# EAGLE design RadioRX (EAGLE 9.6.2)
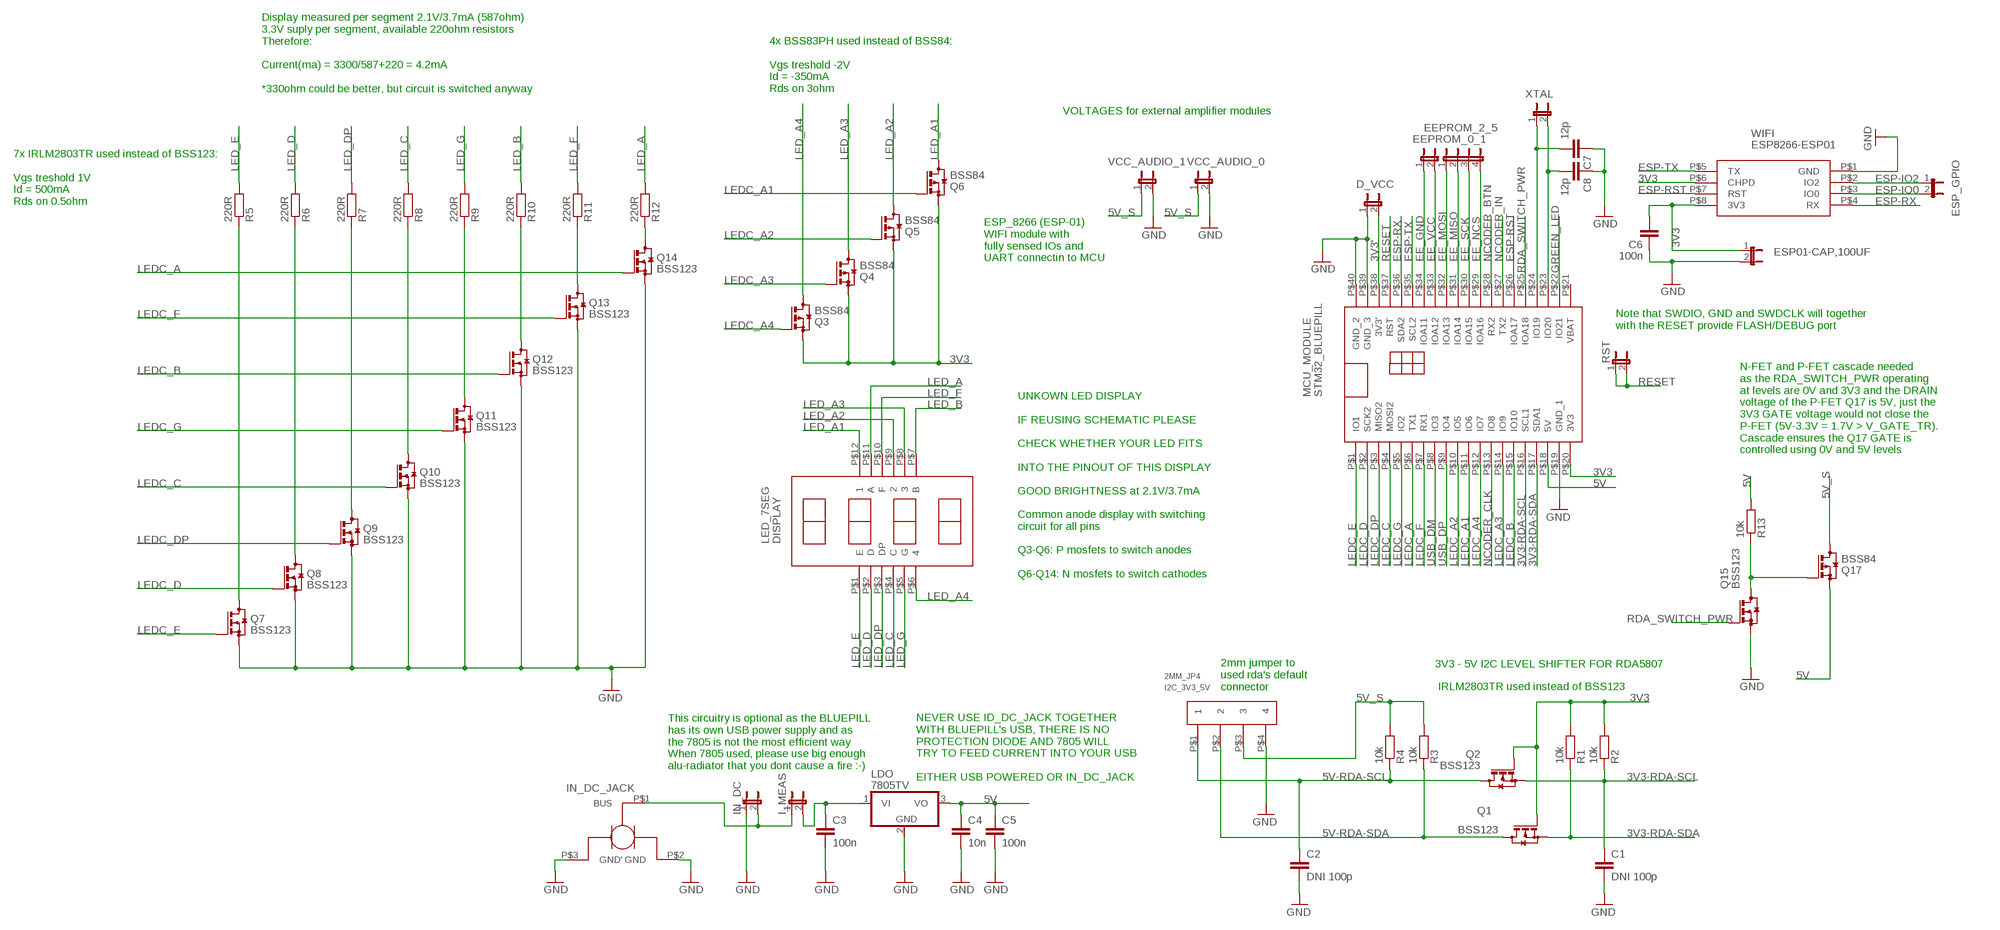
[diagram p0: schematic, sheet 1]

## Parts
C1  DNI 100p  C-EUC0805  [C0805]
C2  DNI 100p  C-EUC0805  [C0805]
C3  100n  C-EUC0805  [C0805]
C4  10n  C-EUC0805  [C0805]
C5  100n  C-EUC0805  [C0805]
C6  100n  C-EUC0805  [C0805]
C7  12p  C-EUC0603  [C0603]
C8  12p  C-EUC0603  [C0603]
D_VCC  JP1E  [JP1]
DISPLAY  LED_7SEG  [LED_7SEG]
EEPROM_0_1  JP1E  [JP1]
EEPROM_2_5  JP4E  [JP4]
ESP01-CAP,100UF  JP1E  [JP1]
ESP_GPIO  JP1E  [JP1]
I2C_3V3_5V  2MM_JP4  [2MM_JP4]
I_MEAS  JP1E  [JP1]
IN_DC  JP1E  [JP1]
IN_DC_JACK  DC_CONN  [DC_CONN]
LDO  7805TV  [TO220V]
MCU_MODULE  STM32_BLUEPILL  [STM32_BLUEPILL]
Q1  BSS123  [SOT23]
Q2  BSS123  [SOT23]
Q3  BSS84  [SOT23]
Q4  BSS84  [SOT23]
Q5  BSS84  [SOT23]
Q6  BSS84  [SOT23]
Q7  BSS123  [SOT23]
Q8  BSS123  [SOT23]
Q9  BSS123  [SOT23]
Q10  BSS123  [SOT23]
Q11  BSS123  [SOT23]
Q12  BSS123  [SOT23]
Q13  BSS123  [SOT23]
Q14  BSS123  [SOT23]
Q15  BSS123  [SOT23]
Q17  BSS84  [SOT23]
R1  10k  R-EU_R0805  [R0805]
R2  10k  R-EU_R0805  [R0805]
R3  10k  R-EU_R0805  [R0805]
R4  10k  R-EU_R0805  [R0805]
R5  220R  R-EU_R0805  [R0805]
R6  220R  R-EU_R0805  [R0805]
R7  220R  R-EU_R0805  [R0805]
R8  220R  R-EU_R0805  [R0805]
R9  220R  R-EU_R0805  [R0805]
R10  220R  R-EU_R0805  [R0805]
R11  220R  R-EU_R0805  [R0805]
R12  220R  R-EU_R0805  [R0805]
R13  10k  R-EU_R0805  [R0805]
RST  JP1E  [JP1]
VCC_AUDIO_0  JP1E  [JP1]
VCC_AUDIO_1  JP1E  [JP1]
WIFI  ESP8266-ESP01  [ESP8266-ESP01]
XTAL  JP1E  [JP1]

## Nets
3V3: C6.2 ESP01-CAP,100UF.1 MCU_MODULE.P$20(3V3) Q1.1(G) Q2.1(G) Q3.2(S) Q4.2(S) Q5.2(S) Q6.2(S) R1.2 R2.2 WIFI.P$6(CHPD) WIFI.P$8(3V3)
3V3': D_VCC.2 MCU_MODULE.P$38(3V3')
3V3-RDA-SCL: C1.1 MCU_MODULE.P$16(SCL1) Q2.2(S) R2.1
3V3-RDA-SDA: MCU_MODULE.P$17(SDA1) Q1.2(S) R1.1
5V: C4.1 C5.1 LDO.3(VO) MCU_MODULE.P$18(5V) Q17.2(S) R13.2
5V-RDA-SCL: C2.1 I2C_3V3_5V.P$1 Q2.3(D) R4.1
5V-RDA-SDA: I2C_3V3_5V.P$2 Q1.3(D) R3.1
5V_S: I2C_3V3_5V.P$3 Q17.3(D) R3.2 R4.2 VCC_AUDIO_0.1 VCC_AUDIO_1.1
EE_GND: EEPROM_0_1.1 MCU_MODULE.P$34(IOA11)
EE_MISO: EEPROM_2_5.2 MCU_MODULE.P$31(IOA14)
EE_MOSI: EEPROM_2_5.1 MCU_MODULE.P$32(IOA13)
EE_NCS: EEPROM_2_5.4 MCU_MODULE.P$29(IOA16)
EE_SCK: EEPROM_2_5.3 MCU_MODULE.P$30(IOA15)
EE_VCC: EEPROM_0_1.2 MCU_MODULE.P$33(IOA12)
ESP-IO0: ESP_GPIO.2 WIFI.P$3(IO0)
ESP-IO2: ESP_GPIO.1 WIFI.P$2(IO2)
ESP-RST: MCU_MODULE.P$26(IOA17) WIFI.P$7(RST)
ESP-RX: MCU_MODULE.P$36(SDA2) WIFI.P$4(RX)
ESP-TX: MCU_MODULE.P$35(SCL2) WIFI.P$5(TX)
GND: C1.2 C2.2 C3.2 C4.2 C5.2 C6.1 C7.1 C8.1 D_VCC.1 ESP01-CAP,100UF.2 I2C_3V3_5V.P$4 IN_DC.1 IN_DC_JACK.P$2(GND) IN_DC_JACK.P$3(GND') LDO.2(GND) MCU_MODULE.P$19(GND_1) MCU_MODULE.P$39(GND_3) MCU_MODULE.P$40(GND_2) Q7.2(S) Q8.2(S) Q9.2(S) Q10.2(S) Q11.2(S) Q12.2(S) Q13.2(S) Q14.2(S) Q15.2(S) VCC_AUDIO_0.2 VCC_AUDIO_1.2 WIFI.P$1(GND)
GREEN_LED: MCU_MODULE.P$22(IO21)
LED_A: DISPLAY.P$11(A) R12.2
LED_A1: DISPLAY.P$12 Q6.3(D)
LED_A2: DISPLAY.P$9 Q5.3(D)
LED_A3: DISPLAY.P$8 Q4.3(D)
LED_A4: DISPLAY.P$6 Q3.3(D)
LED_B: DISPLAY.P$7(B) R10.2
LED_C: DISPLAY.P$4(C) R8.2
LED_D: DISPLAY.P$2(D) R6.2
LED_DP: DISPLAY.P$3(DP) R7.2
LED_E: DISPLAY.P$1(E) R5.2
LED_F: DISPLAY.P$10(F) R11.2
LED_G: DISPLAY.P$5(G) R9.2
LEDC_A: MCU_MODULE.P$6(TX1) Q14.1(G)
LEDC_A1: MCU_MODULE.P$11(IO6) Q6.1(G)
LEDC_A2: MCU_MODULE.P$10(IO5) Q5.1(G)
LEDC_A3: MCU_MODULE.P$14(IO9) Q4.1(G)
LEDC_A4: MCU_MODULE.P$12(IO7) Q3.1(G)
LEDC_B: MCU_MODULE.P$15(IO10) Q12.1(G)
LEDC_C: MCU_MODULE.P$4(MOSI2) Q10.1(G)
LEDC_D: MCU_MODULE.P$2(SCK2) Q8.1(G)
LEDC_DP: MCU_MODULE.P$3(MISO2) Q9.1(G)
LEDC_E: MCU_MODULE.P$1(IO1) Q7.1(G)
LEDC_F: MCU_MODULE.P$7(RX1) Q13.1(G)
LEDC_G: MCU_MODULE.P$5(IO2) Q11.1(G)
N$1: C3.1 I_MEAS.2 LDO.1(VI)
N$2: I_MEAS.1 IN_DC.2 IN_DC_JACK.P$1(BUS)
N$3: C8.2 MCU_MODULE.P$23(IO20) XTAL.2
N$4: C7.2 MCU_MODULE.P$24(IO19) XTAL.1
N$15: Q15.3(D) Q17.1(G) R13.1
N$18: Q7.3(D) R5.1
N$19: Q8.3(D) R6.1
N$20: Q9.3(D) R7.1
N$21: Q10.3(D) R8.1
N$22: Q11.3(D) R9.1
N$23: Q12.3(D) R10.1
N$24: Q13.3(D) R11.1
N$26: Q14.3(D) R12.1
NCODER_BTN: MCU_MODULE.P$28(RX2)
NCODER_CLK: MCU_MODULE.P$13(IO8)
NCODER_IN: MCU_MODULE.P$27(TX2)
RDA_SWITCH_PWR: MCU_MODULE.P$25(IOA18) Q15.1(G)
RESET: MCU_MODULE.P$37(RST) RST.1 RST.2
USB_DM: MCU_MODULE.P$8(IO3)
USB_DP: MCU_MODULE.P$9(IO4)
Unconnected: MCU_MODULE.P$21(VBAT)

## Notes on the sheet
- Display measured per segment 2.1V/3.7mA (587ohm)
  3.3V suply per segment, available 220ohm resistors
  Therefore:
  
  Current(ma) = 3300/587+220 = 4.2mA
  
  *330ohm could be better, but circuit is switched anyway
- 4x BSS83PH used instead of BSS84:
  
  Vgs treshold -2V
  Id = -350mA
  Rds on 3ohm
- VOLTAGES for external amplifier modules
- 7x IRLM2803TR used instead of BSS123:
  
  Vgs treshold 1V
  Id = 500mA
  Rds on 0.5ohm
- ESP_8266 (ESP-01)
  WIFI module with
  fully sensed IOs and
  UART connectin to MCU
- Note that SWDIO, GND and SWDCLK will together
  with the RESET provide FLASH/DEBUG port
- N-FET and P-FET cascade needed
  as the RDA_SWITCH_PWR operating
  at levels are 0V and 3V3 and the DRAIN 
  voltage of the P-FET Q17 is 5V, just the
  3V3 GATE voltage would not close the
  P-FET (5V-3.3V = 1.7V > V_GATE_TR).
  Cascade ensures the Q17 GATE is 
  controlled using 0V and 5V levels
- UNKOWN LED DISPLAY
  
  IF REUSING SCHEMATIC PLEASE
  
  CHECK WHETHER YOUR LED FITS
  
  INTO THE PINOUT OF THIS DISPLAY
  
  GOOD BRIGHTNESS at 2.1V/3.7mA
  
  Common anode display with switching
  circuit for all pins 
  
  Q3-Q6: P mosfets to switch anodes
  
  Q6-Q14: N mosfets to switch cathodes
- 3V3 - 5V I2C LEVEL SHIFTER FOR RDA5807
- 2mm jumper to
  used rda's default
  connector
- IRLM2803TR used instead of BSS123
- This circuitry is optional as the BLUEPILL
  has its own USB power supply and as
  the 7805 is not the most efficient way
  When 7805 used, please use big enough
  alu-radiator that you dont cause a fire :-)
- NEVER USE ID_DC_JACK TOGETHER
  WITH BLUEPILL's USB, THERE IS NO
  PROTECTION DIODE AND 7805 WILL
  TRY TO FEED CURRENT INTO YOUR USB
  
  EITHER USB POWERED OR IN_DC_JACK

## Library data of the parts
C1-C8 = rcl:C-EU: CAPACITOR, European symbol; SPICEPREFIX: C
D_VCC EEPROM_0_1 ESP01-CAP,100UF ESP_GPIO I_MEAS IN_DC RST VCC_AUDIO_0 VCC_AUDIO_1 XTAL = jumper:JP1E: JUMPER
DISPLAY = VladimirSustek:LED_7SEG
EEPROM_2_5 = jumper:JP4E: JUMPER
I2C_3V3_5V = VladimirSustek:2MM_JP4
IN_DC_JACK = VladimirSustek:DC_CONN
LDO = linear:78*: Positive VOLTAGE REGULATOR Source: http://cache.national.com/ds/LM/LM78L05.pdf http://www.fairchildsemi.com/ds/LM/LM7805.pdf
MCU_MODULE = VladimirSustek:STM32_BLUEPILL
Q1 Q2 Q7-Q15 = transistor-small-signal:BSS123: N-CHANNEL MOS FET
Q3-Q6 Q17 = transistor-small-signal:BSS84: P-CHANNEL MOS FET
R1-R13 = rcl:R-EU_: RESISTOR, European symbol; SPICEPREFIX: R
WIFI = VladimirSustek:ESP8266-ESP01

## Board
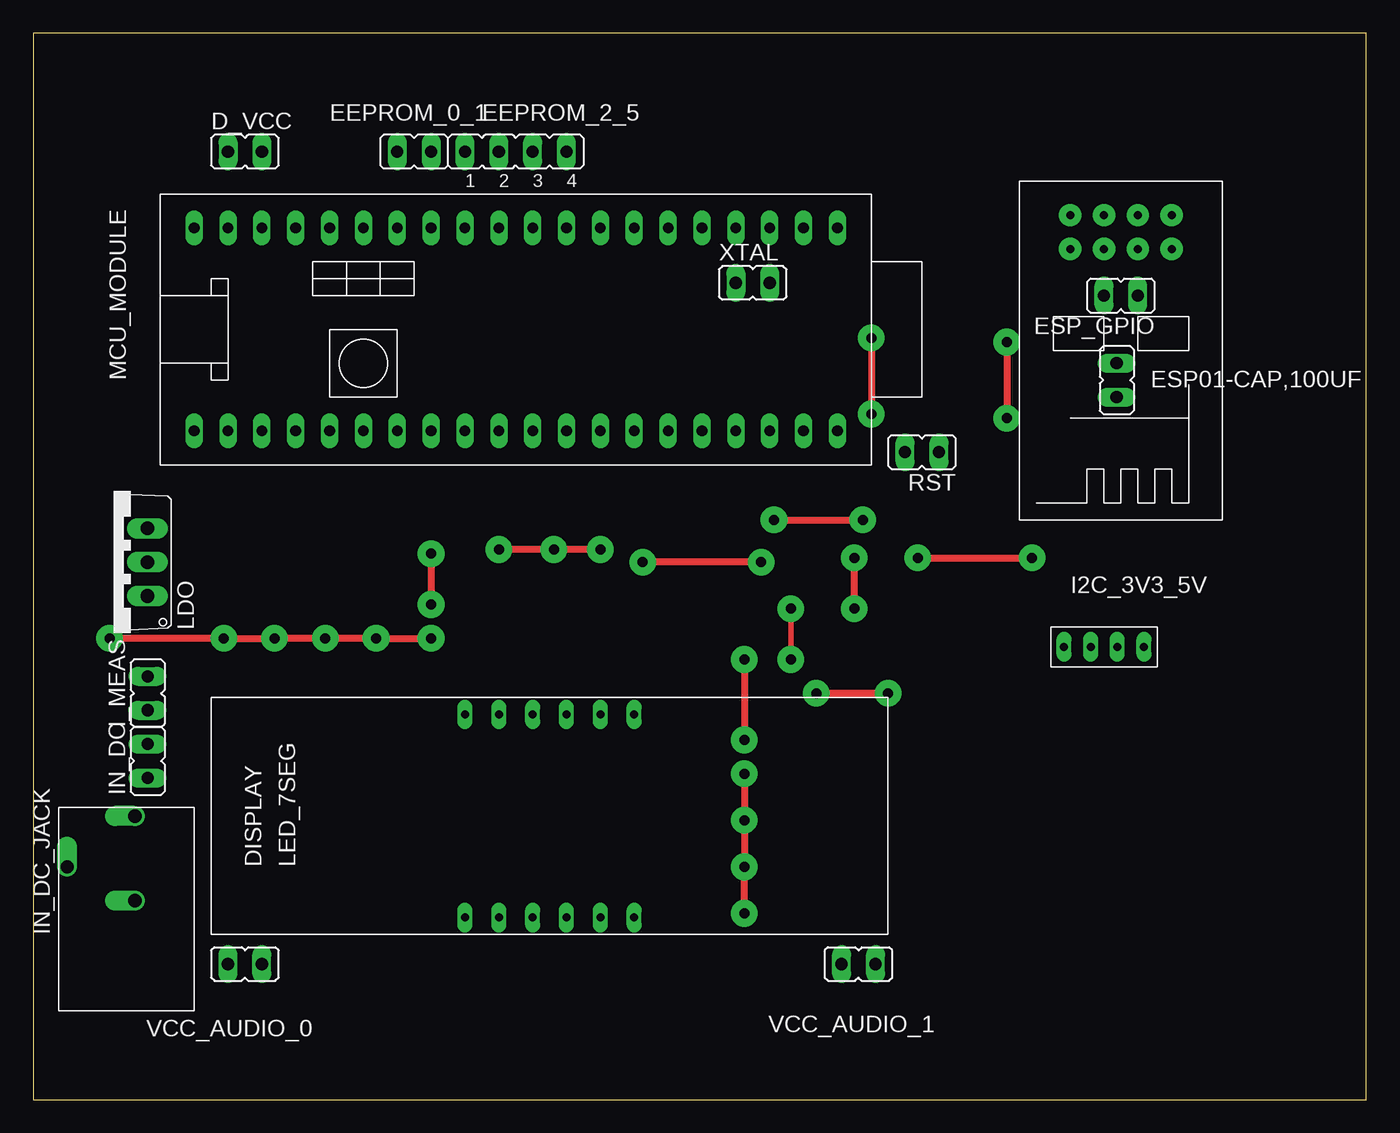
[diagram p1: board, top side]
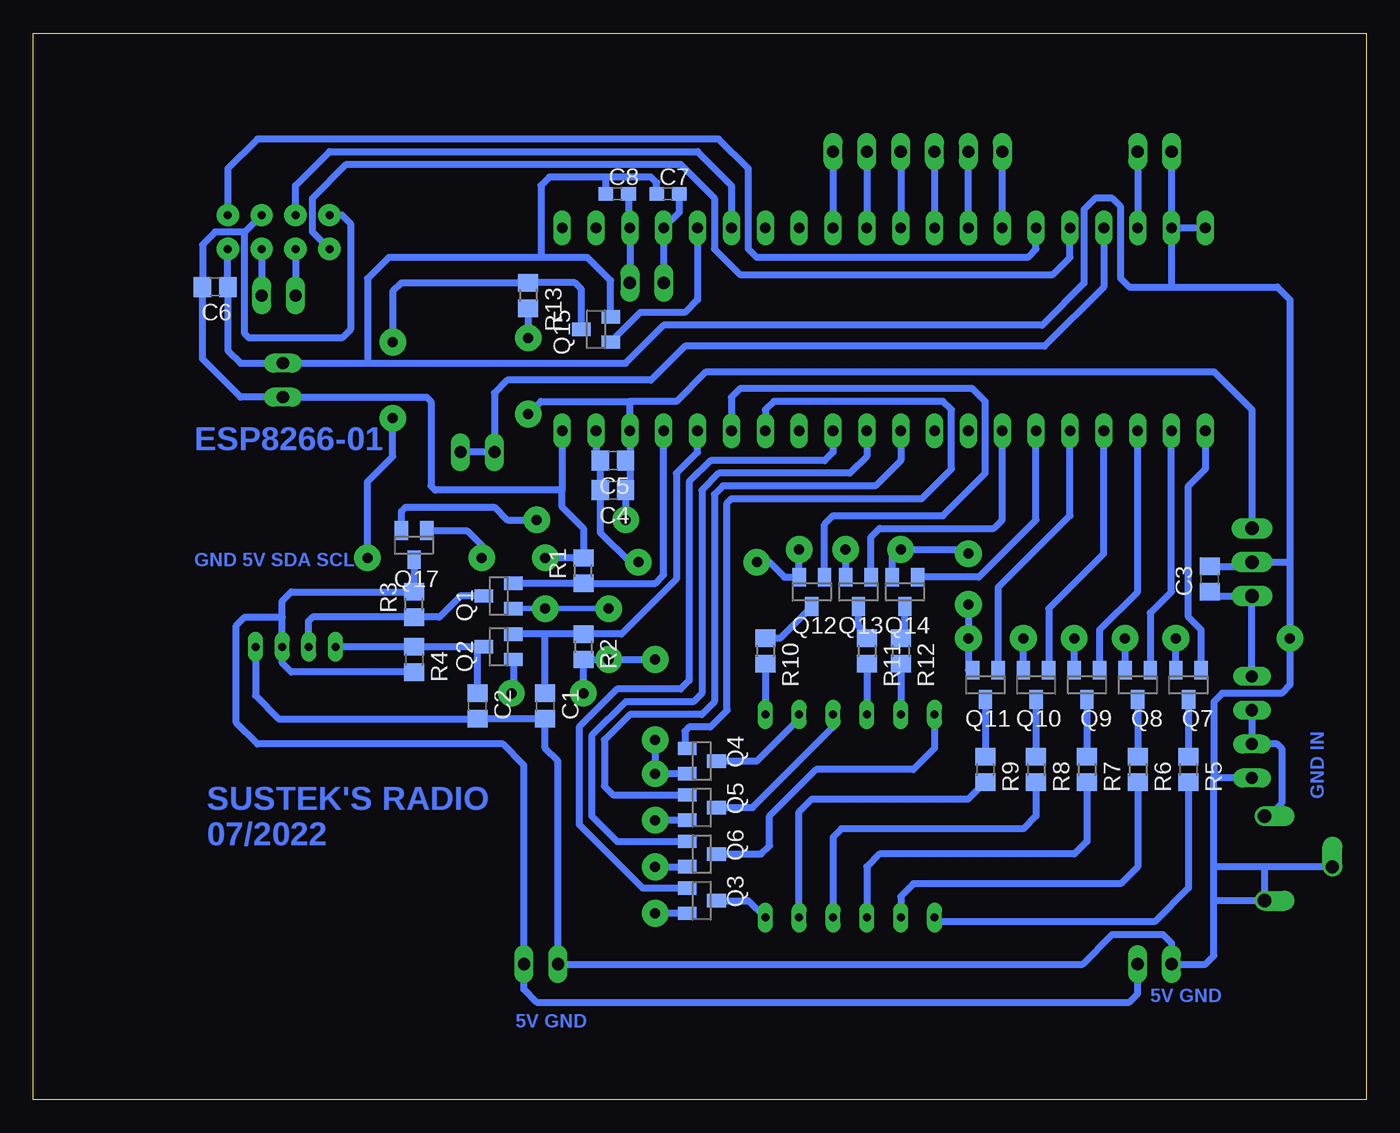
[diagram p2: board, bottom side, seen from below]

Size 100 x 80 mm. Coordinates in mm from the lower left corner, seen from the top.
Outline: 0,0 100,0 100,80 0,80 0,0
Copper layers (1*16): Top 0.035mm / dielectric 1.5mm / Bottom 0.035mm
Design rules "default": minimum track width 6mil, minimum drill 0.35mm, track to track 6mil, track to pad 6mil, pad to pad 6mil, via to via 6mil, smd to smd 6mil, copper to edge 40mil, drill to drill 6mil, minimum pad ring 10mil, minimum via ring 8mil, stop-mask expansion 4mil, vias tented up to drill 0mil, thermal gap 10mil

### Footprints (pad centres in the part's own frame; a part is rotated, then mirrored left to right if it is on the bottom)
C0805 = smd 1.3 x 1.5: 1 -0.95,0; 2 0.95,0
C0603 = smd 1.1 x 1: 1 -0.85,0; 2 0.85,0
JP1 = drill 0.914 long: 1 0,-1.27; 2 0,1.27
LED_7SEG = drill 0.6 long: P$1 -6.35,-7.62; P$2 -3.81,-7.62; P$3 -1.27,-7.62; P$4 1.27,-7.62; P$5 3.81,-7.62; P$6 6.35,-7.62; P$7 6.35,7.62; P$8 3.81,7.62; P$9 1.27,7.62; P$10 -1.27,7.62; P$11 -3.81,7.62; P$12 -6.35,7.62
JP4 = drill 0.914 long: 1 -3.81,0; 2 -1.27,0; 3 1.27,0; 4 3.81,0
2MM_JP4 = drill 0.6 long: P$1 -3,0; P$2 -1,0; P$3 1,0; P$4 3,0
DC_CONN = drill 1 offset: P$1 6.985,-0.635; P$2 0.635,-0.635; P$3 3.175,4.445
TO220V = drill 1.016 long: 1 -2.54,-2.54; 2 0,-2.54; 3 2.54,-2.54
STM32_BLUEPILL = drill 0.8 long: P$1 -24.13,-7.62; P$2 -21.59,-7.62; P$3 -19.05,-7.62; P$4 -16.51,-7.62; P$5 -13.97,-7.62; P$6 -11.43,-7.62; P$7 -8.89,-7.62; P$8 -6.35,-7.62; P$9 -3.81,-7.62; P$10 -1.27,-7.62; P$11 1.27,-7.62; P$12 3.81,-7.62; P$13 6.35,-7.62; P$14 8.89,-7.62; P$15 11.43,-7.62; P$16 13.97,-7.62; P$17 16.51,-7.62; P$18 19.05,-7.62; P$19 21.59,-7.62; P$20 24.13,-7.62; P$21 24.13,7.62; P$22 21.59,7.62; P$23 19.05,7.62; P$24 16.51,7.62; P$25 13.97,7.62; P$26 11.43,7.62; P$27 8.89,7.62; P$28 6.35,7.62; P$29 3.81,7.62; P$30 1.27,7.62; P$31 -1.27,7.62; P$32 -3.81,7.62; P$33 -6.35,7.62; P$34 -8.89,7.62; P$35 -11.43,7.62; P$36 -13.97,7.62; P$37 -16.51,7.62; P$38 -19.05,7.62; P$39 -21.59,7.62; P$40 -24.13,7.62
SOT23 = smd 1 x 1.4: 1 -0.95,-1.1; 2 0.95,-1.1; 3 0,1.1
R0805 = smd 1.3 x 1.5: 1 -0.95,0; 2 0.95,0
ESP8266-ESP01 = drill 0.6 pad 1.676: P$1 -3.81,-7.62; P$2 -1.27,-7.62; P$3 1.27,-7.62; P$4 3.81,-7.62; P$5 -3.81,-10.16; P$6 -1.27,-10.16; P$7 1.27,-10.16; P$8 3.81,-10.16

### Placement (x,y rotation side)
C1  61.59,29.53 270 bottom
C2  66.67,29.53 270 bottom
C3  11.75,39.05 90 bottom
C4  56.52,45.72 180 bottom
C5  56.52,47.94 180 bottom
C6  86.36,60.96 180 bottom
C7  52.39,67.94 0 bottom
C8  56.2,67.94 0 bottom
D_VCC  15.88,71.12 270 top
DISPLAY  38.73,21.27 0 top
EEPROM_0_1  28.57,71.12 270 top
EEPROM_2_5  36.2,71.12 0 top
ESP01-CAP,100UF  81.28,53.98 0 top
ESP_GPIO  81.6,60.33 90 top
I2C_3V3_5V  80.33,33.97 0 top
I_MEAS  8.57,30.48 0 top
IN_DC  8.57,25.4 0 top
IN_DC_JACK  6.99,14.29 90 top
LDO  6.03,40.32 90 top
MCU_MODULE  36.2,57.78 0 top
Q1  65.09,37.78 90 bottom
Q2  65.09,33.97 90 bottom
Q3  49.85,14.92 270 bottom
Q4  49.85,25.4 270 bottom
Q5  49.85,21.91 270 bottom
Q6  49.85,18.41 270 bottom
Q7  13.34,31.11 180 bottom
Q8  17.14,31.11 180 bottom
Q9  20.95,31.11 180 bottom
Q10  24.77,31.11 180 bottom
Q11  28.57,31.11 180 bottom
Q12  41.59,38.1 180 bottom
Q13  38.1,38.1 180 bottom
Q14  34.61,38.1 180 bottom
Q15  57.78,57.78 90 bottom
Q17  71.44,41.59 180 bottom
R1  58.74,39.69 90 bottom
R2  58.74,33.97 270 bottom
R3  71.44,37.15 90 bottom
R4  71.44,33.02 270 bottom
R5  13.34,24.77 270 bottom
R6  17.14,24.77 270 bottom
R7  20.95,24.77 270 bottom
R8  24.77,24.77 270 bottom
R9  28.57,24.77 270 bottom
R10  45.09,33.66 270 bottom
R11  37.47,33.66 270 bottom
R12  34.92,33.66 270 bottom
R13  62.87,60.33 270 bottom
RST  66.67,48.58 90 top
VCC_AUDIO_0  15.88,10.16 90 top
VCC_AUDIO_1  61.91,10.16 90 top
WIFI  81.6,56.2 180 top
XTAL  53.98,61.28 270 top

### Tracks (layer width: path | path; a pad name or v marks a point on that pad's centre or on a via)
3V3  (via drill 0.75 pad 2)
  Top 0.406: v56.83,36.83 v56.83,33.02
  Top 0.508: v53.34,13.97 v53.34,17.46 v53.34,20.95 v53.34,24.45 | v53.34,33.02 v53.34,26.99 | v64.14,30.48 v58.74,30.48 | v61.59,36.83 v61.59,40.64
  Bottom 0.406: Q1.1 v61.59,36.83 v56.83,36.83
  Bottom 0.508: 60.33,45.72 60.33,44.45 58.74,42.86 R1.2 v61.59,40.64 | 60.33,45.72 69.85,45.72 70.17,46.04 70.17,52.39 70.48,52.7 ESP01-CAP,100UF.1 84.45,52.7 87.31,55.56 C6.2 87.31,64.14 86.36,65.09 84.14,65.09 | Q3.2 v53.34,13.97 | v53.34,17.46 Q6.2 | Q5.2 v53.34,20.96 v53.34,20.95 | R2.2 | R2.2 v56.83,33.02 v53.34,33.02 | v53.34,26.99 v53.34,24.45 Q4.2 | Q2.1 63.99,30.48 v64.14,30.48 | v58.74,30.48 v58.73,30.48 R2.2 | WIFI.P$8 76.83,66.36 76.2,65.72 76.2,57.78 76.83,57.15 83.82,57.15 84.14,57.47 84.14,65.09 | WIFI.P$6 84.14,65.09 | MCU_MODULE.P$20 60.33,45.72
3V3'
  Bottom 0.508: D_VCC.2 MCU_MODULE.P$38
3V3-RDA-SCL
  Bottom 0.508: 61.59,34.92 R2.1 55.88,34.92 51.75,39.05 51.75,46.99 50.16,48.58 MCU_MODULE.P$16 | 61.59,34.92 Q2.2 | C1.1 61.59,34.92
3V3-RDA-SDA
  Bottom 0.508: Q1.2 R1.1 53.34,38.74 52.7,39.37 MCU_MODULE.P$17
5V  (via drill 0.75 pad 2)
  Top 0.508: v55.56,43.5 v62.23,43.5 | v62.87,57.15 v62.87,51.44
  Bottom 0.508: LDO.3 8.57,51.75 11.43,54.61 49.53,54.61 51.75,52.39 55.24,52.39 | 55.24,48.26 55.24,46.04 C4.1 v55.56,43.5 | 55.24,48.26 MCU_MODULE.P$18 55.24,52.39 | 55.24,48.26 C5.1 | Q17.2 72.39,44.13 72.07,44.45 65.41,44.45 64.45,43.5 v62.23,43.5 | v62.87,51.44 61.91,52.39 55.24,52.39 | R13.2 v62.87,57.15
5V-RDA-SCL
  Bottom 0.508: Q2.3 66.67,33.97 | 66.67,33.97 R4.1 I2C_3V3_5V.P$1 | C2.1 66.67,33.97
5V-RDA-SDA
  Bottom 0.508: Q1.3 67.94,37.78 69.53,36.2 R3.1 79.06,36.2 79.38,35.88 I2C_3V3_5V.P$2
5V_S
  Bottom 0.508: R4.2 80.65,32.07 81.33,32.75 I2C_3V3_5V.P$3 81.33,36.2 | VCC_AUDIO_0.1 17.14,7.94 17.78,7.3 62.23,7.3 63.18,8.26 VCC_AUDIO_1.1 63.18,25.08 64.77,26.67 83.19,26.67 84.77,28.26 84.77,35.56 84.14,36.2 81.33,36.2 | 81.33,36.2 81.33,37.42 80.64,38.1 R3.2 Q17.3
EE_GND
  Bottom 0.508: MCU_MODULE.P$34 EEPROM_0_1.1
EE_MISO
  Bottom 0.508: EEPROM_2_5.2 MCU_MODULE.P$31
EE_MOSI
  Bottom 0.508: EEPROM_2_5.1 MCU_MODULE.P$32
EE_NCS
  Bottom 0.508: EEPROM_2_5.4 MCU_MODULE.P$29
EE_SCK
  Bottom 0.508: EEPROM_2_5.3 MCU_MODULE.P$30
EE_VCC
  Bottom 0.508: MCU_MODULE.P$33 EEPROM_0_1.2
ESP-IO0
  Bottom 0.508: WIFI.P$3 ESP_GPIO.2
ESP-IO2
  Bottom 0.508: WIFI.P$2 ESP_GPIO.1
ESP-RST
  Bottom 0.508: WIFI.P$7 80.33,68.58 77.79,71.12 50.16,71.12 47.62,68.58 MCU_MODULE.P$26
ESP-RX
  Bottom 0.508: WIFI.P$4 79.06,65.09 79.06,67.63 76.52,70.17 51.44,70.17 48.9,67.63 48.9,63.82 46.99,61.91 23.5,61.91 22.23,63.18 MCU_MODULE.P$36
ESP-TX
  Bottom 0.508: WIFI.P$5 85.41,69.85 83.19,72.07 48.58,72.07 46.35,69.85 46.35,63.82 45.72,63.18 25.4,63.18 24.77,63.82 MCU_MODULE.P$35
GND  (via drill 0.75 pad 2)
  Top 0.508: v29.84,34.61 v25.72,34.61 v21.91,34.61 v18.1,34.61 v14.29,34.61 v5.71,34.61 | v42.55,41.27 v39.05,41.27 v34.92,41.27 | v29.84,40.96 v29.84,37.15 | v54.61,40.32 v45.72,40.32
  Bottom 0.508: C3.2 8.89,40 LDO.2 5.71,40.32 | 5.71,40.32 5.71,60.01 6.67,60.96 14.61,60.96 | 5.71,40.32 v5.71,34.61 5.71,31.11 6.35,30.48 10.79,30.48 11.43,29.84 11.43,24.13 | Q7.2 v14.29,34.6 v14.29,34.61 | v18.1,34.61 Q8.2 | Q9.2 v21.91,34.6 v21.91,34.61 | Q10.2 v25.71,34.6 v25.72,34.61 | v42.55,41.27 v42.54,41.27 Q12.2 43.65,39.2 44.77,40.32 v45.72,40.32 | v39.05,41.27 Q13.2 | Q14.2 35.56,40.64 v34.92,41.27 30.16,41.27 v29.84,40.96 | v54.61,40.32 55.24,40.32 57.47,42.54 C4.2 C5.2 57.78,48.26 MCU_MODULE.P$19 | v29.84,37.15 v29.84,34.61 29.84,32.22 Q11.2 | 14.61,60.96 17.78,60.96 18.41,61.59 18.41,66.99 19.05,67.63 20.32,67.63 21.16,66.78 21.16,61.24 24.3,58.1 52.7,58.1 55.56,55.24 74.93,55.24 | WIFI.P$1 C6.1 85.41,56.2 84.45,55.24 ESP01-CAP,100UF.2 74.93,55.24 | IN_DC.1 11.43,24.13 | 11.43,14.92 11.43,10.79 12.06,10.16 VCC_AUDIO_0.2 14.61,11.75 15.24,12.38 19.05,12.38 21.27,10.16 VCC_AUDIO_1.2 60.64,25.4 61.59,26.35 C1.2 C2.2 81.6,28.57 83.33,30.3 I2C_3V3_5V.P$4 | 11.43,14.92 11.43,17.46 | 11.43,17.46 11.43,24.13 | IN_DC_JACK.P$3 7.62,17.46 | 7.62,17.46 11.43,17.46 | 11.43,14.92 IN_DC_JACK.P$2 7.62,17.46 | MCU_MODULE.P$39 MCU_MODULE.P$40 | D_VCC.1 MCU_MODULE.P$39 | MCU_MODULE.P$39 14.61,60.96 | Q15.2 56.69,61.45 58.42,63.18 61.91,63.18 | 61.91,63.18 73.34,63.18 74.93,61.59 74.93,55.24 | C7.1 53.24,68.8 53.66,69.22 57.15,69.22 | 61.91,63.18 61.91,68.58 61.28,69.22 57.15,69.22 | C8.1 57.05,69.11 57.15,69.22
LED_A
  Bottom 0.508: R12.2 DISPLAY.P$11
LED_A1
  Bottom 0.508: Q6.3 45.4,18.41 44.77,19.05 44.77,21.27 41.27,24.77 33.97,24.77 32.38,26.35 DISPLAY.P$12
LED_A2
  Bottom 0.508: Q5.3 46.04,21.91 40.01,27.94 DISPLAY.P$9
LED_A3
  Bottom 0.508: Q4.3 45.72,25.4 42.55,28.57 DISPLAY.P$8
LED_A4
  Bottom 0.508: DISPLAY.P$6 46.35,14.92 Q3.3
LED_B
  Bottom 0.508: R10.2 DISPLAY.P$7
LED_C
  Bottom 0.508: R8.2 24.77,21.27 25.72,20.32 39.37,20.32 40.01,19.68 DISPLAY.P$4
LED_D
  Bottom 0.508: R6.2 17.14,17.46 18.41,16.19 33.97,16.19 34.92,15.24 DISPLAY.P$2
LED_DP
  Bottom 0.508: R7.2 20.95,19.37 21.91,18.41 36.51,18.41 37.47,17.46 DISPLAY.P$3
LED_E
  Bottom 0.508: R5.2 13.34,15.88 15.88,13.34 32.07,13.34 DISPLAY.P$1
LED_F
  Bottom 0.508: R11.2 DISPLAY.P$10
LED_G
  Bottom 0.508: R9.2 29.85,22.54 41.59,22.54 42.55,21.59 DISPLAY.P$5
LEDC_A
  Bottom 0.508: Q14.1 29.06,39.2 24.77,43.5 MCU_MODULE.P$6
LEDC_A1
  Bottom 0.508: Q6.1 56.2,19.36 58.1,21.27 58.1,27.3 55.56,29.84 50.48,29.84 49.85,30.48 49.85,45.72 48.58,46.99 38.73,46.99 37.47,48.26 MCU_MODULE.P$11
LEDC_A2
  Bottom 0.508: Q5.1 56.51,22.86 57.15,23.5 57.15,26.99 55.24,28.89 49.85,28.89 48.9,29.84 48.9,45.4 48.26,46.04 36.83,46.04 34.92,47.94 MCU_MODULE.P$10
LEDC_A3
  Bottom 0.508: Q4.1 51.12,26.52 51.12,27.62 50.8,27.94 49.21,27.94 47.94,29.21 47.94,44.77 47.62,45.09 33.34,45.09 31.11,47.31 31.11,51.75 31.75,52.39 44.45,52.39 45.09,51.75 MCU_MODULE.P$14
LEDC_A4
  Bottom 0.508: Q3.1 54.29,15.87 59.05,20.64 59.05,27.94 56.2,30.8 51.44,30.8 50.8,31.43 50.8,46.35 49.21,47.94 40.64,47.94 40.01,48.58 MCU_MODULE.P$12
LEDC_B
  Bottom 0.508: Q12.1 40.64,43.18 40.01,43.81 31.75,43.81 28.57,46.99 28.57,52.39 29.53,53.34 46.99,53.34 47.62,52.7 MCU_MODULE.P$15
LEDC_C
  Bottom 0.508: Q10.1 23.82,36.83 19.68,40.96 MCU_MODULE.P$4
LEDC_D
  Bottom 0.508: Q8.1 16.2,36.51 14.61,38.1 MCU_MODULE.P$2
LEDC_DP
  Bottom 0.508: Q9.1 20,35.24 17.14,38.1 MCU_MODULE.P$3
LEDC_E
  Bottom 0.508: Q7.1 12.38,35.24 13.34,36.2 13.34,46.04 12.06,47.31 MCU_MODULE.P$1
LEDC_F
  Bottom 0.508: Q13.1 37.15,42.23 36.51,42.86 27.94,42.86 27.3,43.5 MCU_MODULE.P$7
LEDC_G
  Bottom 0.508: Q11.1 27.62,38.41 22.38,43.66 22.23,43.81 MCU_MODULE.P$5
N$1
  Bottom 0.508: I_MEAS.2 LDO.1 11.43,37.78 C3.1
N$2
  Bottom 0.508: I_MEAS.1 IN_DC.2 6.67,26.67 6.35,26.35 6.35,22.23 7.3,21.27 IN_DC_JACK.P$1
N$3
  Bottom 0.508: XTAL.2 MCU_MODULE.P$23 55.35,65.51 C8.2
N$4
  Bottom 0.508: XTAL.1 MCU_MODULE.P$24 51.54,66.57 C7.2
N$15  (via drill 0.75 pad 2)
  Top 0.508: v73.03,56.83 v73.03,51.12 | v66.36,40.64 v74.93,40.64
  Bottom 0.508: Q17.1 67.46,42.69 66.36,41.59 v66.36,40.64 | v74.93,40.64 74.93,46.35 73.03,48.26 v73.03,51.12 | Q15.3 58.88,60.79 59.37,61.28 R13.1 72.39,61.27 73.03,60.64 v73.03,56.83
N$18
  Bottom 0.508: Q7.3 R5.1
N$19
  Bottom 0.508: Q8.3 R6.1
N$20
  Bottom 0.508: Q9.3 R7.1
N$21
  Bottom 0.508: Q10.3 R8.1
N$22
  Bottom 0.508: Q11.3 R9.1
N$23
  Bottom 0.508: Q12.3 43.99,34.6 R10.1
N$24
  Bottom 0.508: R11.1 37.47,34.92 38.1,35.56 Q13.3
N$26
  Bottom 0.508: R12.1 34.61,34.92 Q14.3
RDA_SWITCH_PWR
  Bottom 0.508: MCU_MODULE.P$25 50.16,60.01 51.12,59.05 54.47,59.05 Q15.1
RESET
  Bottom 0.508: RST.1 RST.2 65.41,53.02 64.45,53.98 53.66,53.98 51.12,56.52 24.13,56.52 19.68,60.96 MCU_MODULE.P$37

### Text on the board
Bottom: ESP8266-01 | GND 5V SDA SCL | GND IN | SUSTEK'S RADIO / 07/2022 | 5V GND | 5V GND